# Altium schematic sheet IO_Connectors.SchDoc: =ProjectName
size 420 x 297 mm; Author: T.P.; CompanyName: WUT; DrawnBy: T.P.; Organization: WUT ISE; Address1: Warsaw Univeristy of Technology; Address2: Nowowiejska 15/19; DocumentNumber: 36; Revision: 0.9; SheetNumber: 36; SheetTotal: 36; EDA_Number: ARTIQ; Projet: ARTIQ/SINARA; ModifiedBy: -; CreateDate: XX/XX/XXXX; CheckedDate: -; Title2: IO_Connectors.SchDoc; DivGrp: ISE; Designer: G.K. and T.P.
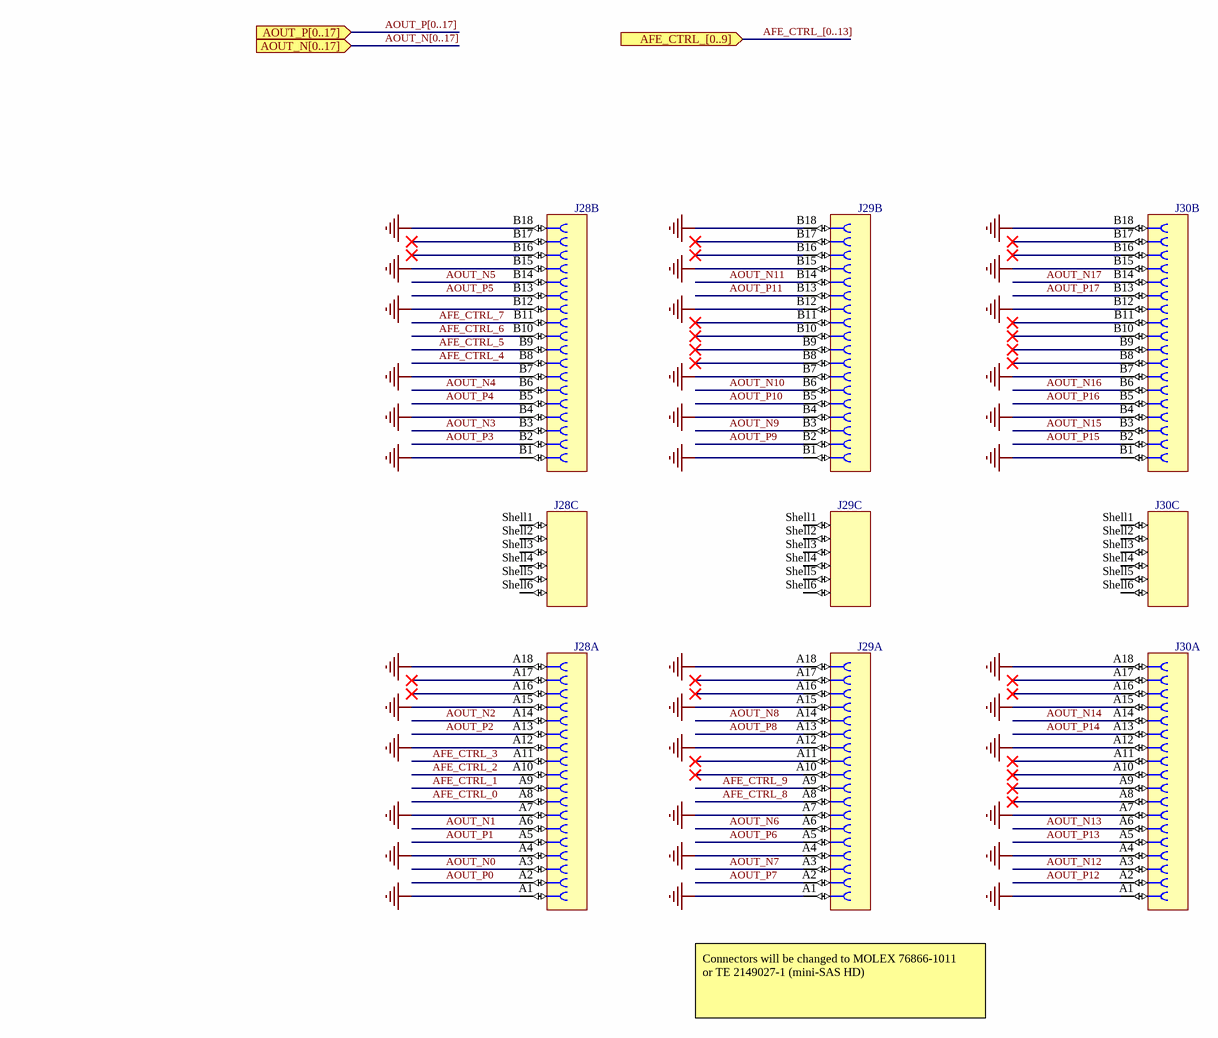
[diagram p0: IO_Connectors.SchDoc]

## Parts
J28  iPass™  [MOLEX_75783-0107]  (value not drawn)  (parts A,B,C of 3)
J29  iPass™  [MOLEX_75783-0107]  (value not drawn)  (parts A,B,C of 3)
J30  iPass™  [MOLEX_75783-0107]  (value not drawn)  (parts A,B,C of 3)

## Ports
AFE_CTRL_[0..9] (in), AOUT_N[0..17] (in), AOUT_P[0..17] (in)

## Nets
GND: J28.A1 J28.A4 J28.A7 J28.A12 J28.A15 J28.A18 J28.B1 J28.B4 J28.B7 J28.B12 J28.B15 J28.B18 J29.A1 J29.A4 J29.A7 J29.A12 J29.A15 J29.A18 J29.B1 J29.B4 J29.B7 J29.B12 J29.B15 J29.B18 J30.A1 J30.A4 J30.A7 J30.A12 J30.A15 J30.A18 J30.B1 J30.B4 J30.B7 J30.B12 J30.B15 J30.B18
AFE_CTRL_0: J28.A8
AFE_CTRL_1: J28.A9
AFE_CTRL_2: J28.A10
AFE_CTRL_3: J28.A11
AFE_CTRL_4: J28.B8
AFE_CTRL_5: J28.B9
AFE_CTRL_6: J28.B10
AFE_CTRL_7: J28.B11
AFE_CTRL_8: J29.A8
AFE_CTRL_9: J29.A9
AOUT_N0: J28.A3
AOUT_N1: J28.A6
AOUT_N2: J28.A14
AOUT_N3: J28.B3
AOUT_N4: J28.B6
AOUT_N5: J28.B14
AOUT_N6: J29.A6
AOUT_N7: J29.A3
AOUT_N8: J29.A14
AOUT_N9: J29.B3
AOUT_N10: J29.B6
AOUT_N11: J29.B14
AOUT_N12: J30.A3
AOUT_N13: J30.A6
AOUT_N14: J30.A14
AOUT_N15: J30.B3
AOUT_N16: J30.B6
AOUT_N17: J30.B14
AOUT_P0: J28.A2
AOUT_P1: J28.A5
AOUT_P2: J28.A13
AOUT_P3: J28.B2
AOUT_P4: J28.B5
AOUT_P5: J28.B13
AOUT_P6: J29.A5
AOUT_P7: J29.A2
AOUT_P8: J29.A13
AOUT_P9: J29.B2
AOUT_P10: J29.B5
AOUT_P11: J29.B13
AOUT_P12: J30.A2
AOUT_P13: J30.A5
AOUT_P14: J30.A13
AOUT_P15: J30.B2
AOUT_P16: J30.B5
AOUT_P17: J30.B13

Not connected (* = marked no-connect by the designer): J28 A16* A17* B16* B17* Shell1 Shell2 Shell3 Shell4 Shell5 Shell6; J29 A10* A11* A16* A17* B8* B9* B10* B11* B16* B17* Shell1 Shell2 Shell3 Shell4 Shell5 Shell6; J30 A8* A9* A10* A11* A16* A17* B8* B9* B10* B11* B16* B17* Shell1 Shell2 Shell3 Shell4 Shell5 Shell6

## Buses and harness runs
bus AFE_CTRL_[0..13] = port AFE_CTRL_[0..9]
bus AOUT_N[0..17] = port AOUT_N[0..17]
bus AOUT_P[0..17] = port AOUT_P[0..17]

## Notes on the sheet
- (near J29) Connectors will be changed to MOLEX 76866-1011
  or TE 2149027-1 (mini-SAS HD)
- Project/Equipment
- Document
- Designer
- Drawn by
- Check.by
- File
- Last Mod.
- Print Date
- Sheet
- Size
- A3
- of
- Rev

## Library data of the parts
J28-J30 = MOLEX_75783-0107: 36 Circuit, Right Angle , Internal Assembly, iPass™ I/O Surface Mount Receptacle with Left Key Shell; Manufacturer: MOLEX; PressFit: No; Part Number: MOLEX_75783-0107; Component Kind: Standard; Component Type: Standard; Pin Count: 42; Family: iPass™; Mounted: Yes; Socket: No; SMD: Yes; Sense: No; Status: None; Part Description: 36 Circuit, Right Angle , Internal Assembly, iPass™ I/O Surface Mount Receptacle with Left Key Shell; Manufacturer Part Number: 75783-0107; ComponentHeight: 8.47mm; HelpURL: \\cern.ch\dfs\Applications\Altium\Datasheets\MOLEX_75783-0107.pdf; Author: CERN DEM JLC; CreateDate: 12.11.2014; LatestRevisionDate: 12.11.2014